# EAGLE design pwrfet (EAGLE 4.13)

## Sheet 1 of 2
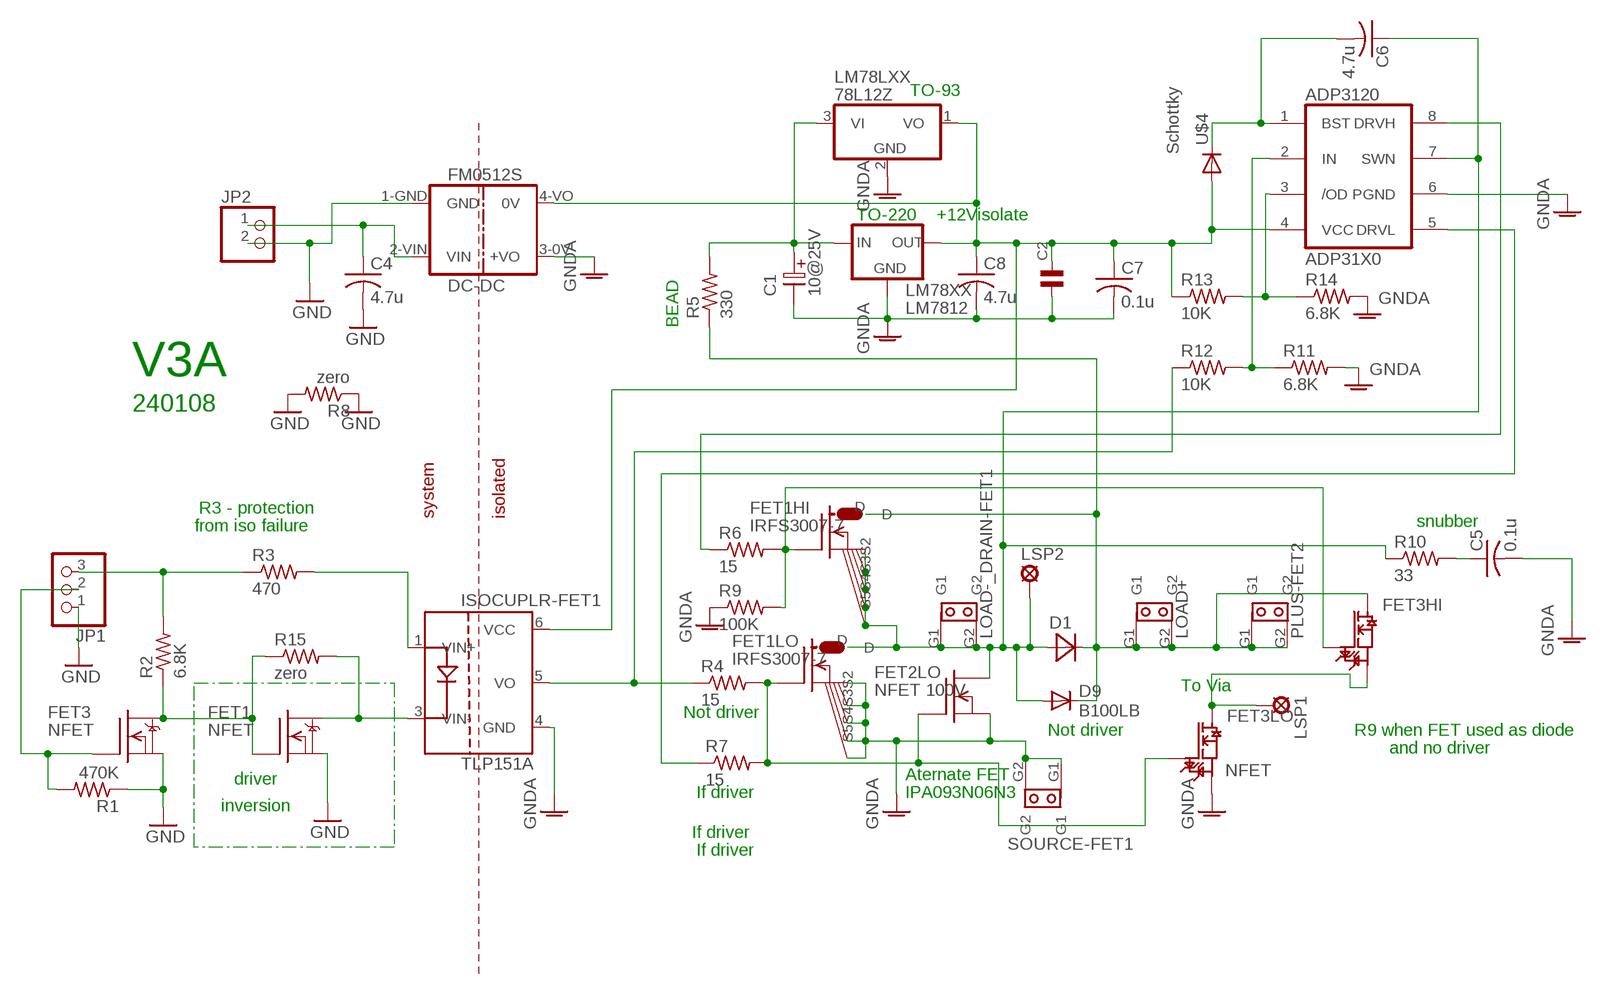
[diagram p0: schematic, sheet 1]

### Parts
ADP3120  ADP31X0  [SO08]
C1  10@25V  ELC-2,5L  [ES-2,5L]
C2  C1210  [1210]
C4  4.7u  C-USC0805  [C0805]
C5  0.1u  C-USC0603  [C0603]
C6  4.7u  C-USC0805  [C0805]
C7  0.1u  C-USC0603  [C0603]
C8  4.7u  C-USC0805  [C0805]
D1  DIODE-10  [D-10]
D9  B100LB  [SMB_1]
FET1  NFET  DMN3404L  [SOT-23]
FET1HI  IRFS3007-7  [D2PAK-7]
FET1LO  IRFS3007-7  [D2PAK-7]
FET2LO  NFET 100V  RFP30N06  [TO220V]
FET3  NFET  DMN3404L  [SOT-23]
FET3HI  NFET-DT  [D-PAK-4]
FET3LO  NFET  NFET-DT  [D-PAK-4]
FM0512S  DC-DC  [DC-DC]
ISOCUPLR-FET1  TLP151A  [SOT23-5X]
JP1  PINHD-1X3  [1X03]
JP2  PINHD-1X2  [1X02]
LM78LXX  78L12Z  [TO92]
LM78XX  LM7812  78XXS  [78XXS]
LOAD+  SPADE-TAB  [SPADE_TAB]
LOAD-_DRAIN-FET1  SPADE-TAB  [SPADE_TAB]
LSP1  LoadB  LSP10  [LSP10]
LSP2  LoadB  LSP10  [LSP10]
PLUS-FET2  SPADE-TAB  [SPADE_TAB]
R1  470K  R-US_R0603  [R0603]
R2  6.8K  R-US_R0603  [R0603]
R3  470  R-US_R0603  [R0603]
R4  15  R-US_R0603  [R0603]
R5  330  R-US_R0603  [R0603]
R6  15  R-US_R0603  [R0603]
R7  15  R-US_R0603  [R0603]
R8  zero  R-US_R0603  [R0603]
R9  100K  R-US_R0603  [R0603]
R10  33  R-US_R0603  [R0603]
R11  6.8K  R-US_R0603  [R0603]
R12  10K  R-US_R0603  [R0603]
R13  10K  R-US_R0603  [R0603]
R14  6.8K  R-US_R0603  [R0603]
R15  zero  R-US_R0603  [R0603]
SOURCE-FET1  SPADE-TAB  [SPADE_TAB]
U$4  Schottky  PMEG10020PMEG10020-123W  [SOD123W]

### Nets
+5VAUX: C4.1 FM0512S.2-VIN(VIN) JP2.1
+12VISO: ADP3120.4(VCC) C2.2 C7.1 C8.1 FM0512S.4-VO(0V) ISOCUPLR-FET1.6(VCC) LM78LXX.1(VO) LM78XX.OUT R13.1 U$4.C(A)
+PWR: D1.2(K) D9.C FET1HI.D FET3HI.D LOAD+.G1 LOAD+.G2 PLUS-FET2.G1 PLUS-FET2.G2 R5.1
+PWR_RC: C1.1 LM78LXX.3(VI) LM78XX.IN R5.2
/OD: ADP3120.3(/OD) R13.2 R14.1
DRAINFET1: ADP3120.7(SWN) C6.1 D1.1(A) D9.A FET1HI.S2(S1) FET1HI.S3(S2) FET1HI.S5(S3) FET1HI.S6(S4) FET1HI.S7(S5) FET1LO.D FET2LO.2(D) LOAD-_DRAIN-FET1.G1 LOAD-_DRAIN-FET1.G2 LSP2.MP R10.1
FET2GATE: FET1HI.G FET3HI.G R6.2 R9.2
FET3-LOAD: FET3HI.S FET3LO.D LSP1.MP
GATE-FET1: FET1LO.G FET2LO.1(G) FET3LO.G R4.2 R7.2
GND: C4.2 FET1.2(S) FET3.2(S) FM0512S.1-GND(GND) JP1.1 JP2.2 R1.1 R8.1 R8.2
GNDA: ADP3120.6(PGND) C1.2 C2.1 C5.2 C7.2 C8.2 FET1LO.S2(S1) FET1LO.S3(S2) FET1LO.S5(S3) FET1LO.S6(S4) FET1LO.S7(S5) FET2LO.3(S) FET3LO.S FM0512S.3-0V(+VO) ISOCUPLR-FET1.4(GND) LM78LXX.2(GND) LM78XX.GND R9.1 R11.2 R14.2 SOURCE-FET1.G1 SOURCE-FET1.G2
HO: ADP3120.8(DRVH) R6.1
IN: ISOCUPLR-FET1.5(VO) R4.1 R12.1
IN-DIVIDED: ADP3120.2(IN) R11.1 R12.2
ISO-ANODE: ISOCUPLR-FET1.1(VIN+) R3.2
ISO-IN-DRAIN-FET1: FET1.1(G) FET3.3(D) R2.1 R15.1
LO: ADP3120.5(DRVL) R7.1
N$1: JP1.3 R2.2 R3.1
N$2: FET1.3(D) ISOCUPLR-FET1.3(VIN-) R15.2
N$3: ADP3120.1(BST) C6.2 U$4.A(C)
ONOFF-FET1: FET3.1(G) JP1.2 R1.2
SNUB-RC: C5.1 R10.2

### Notes on the sheet
- TO-93
- TO-220 | +12Visolate
- BEAD
- V3A
- 240108
- R3 - protection | system | isolated
- from iso failure | snubber
- To Via
- Not driver
- Not driver | R9 when FET used as diode
- and no driver
- driver | Aternate FET
- If driver | IPA093N06N3
- inversion
- If driver
- If driver

## Sheet 2 of 2

## Library data of the parts
ADP3120 = 74xx-us:ADP31X0
C1 = DEH:ELC-2,5L
C2 = capsmd:C1210
C4-C8 = rcl:C-US: CAPACITOR, American symbol
D1 = DEH:DIODE-10
D9 = diode-1:B100LB
FET1 FET3 = transistor-fet:DMN3404L
FET1HI FET1LO = transistor-fet:IRFS3007-7
FET2LO = transistor-fet:RFP30N06
FET3HI FET3LO = DEH:NFET-DT
FM0512S = DEH:DC-DC
ISOCUPLR-FET1 = texas:TLP151A
JP1 = pinhead:PINHD-1X3: PIN HEADER
JP2 = pinhead:PINHD-1X2: PIN HEADER
LM78LXX = linear:78*: Positive VOLTAGE REGULATOR
LM78XX = v-reg:78XXS: VOLTAGE REGULATOR
LOAD+ LOAD-_DRAIN-FET1 PLUS-FET2 SOURCE-FET1 = DEH:SPADE-TAB
LSP1 LSP2 = solpad:LSP10: SOLDER PAD drill 1.0 mm, distributor Buerklin, 12H555
R1-R15 = rcl:R-US_: RESISTOR, American symbol
U$4 = diode-1:PMEG10020

## Board
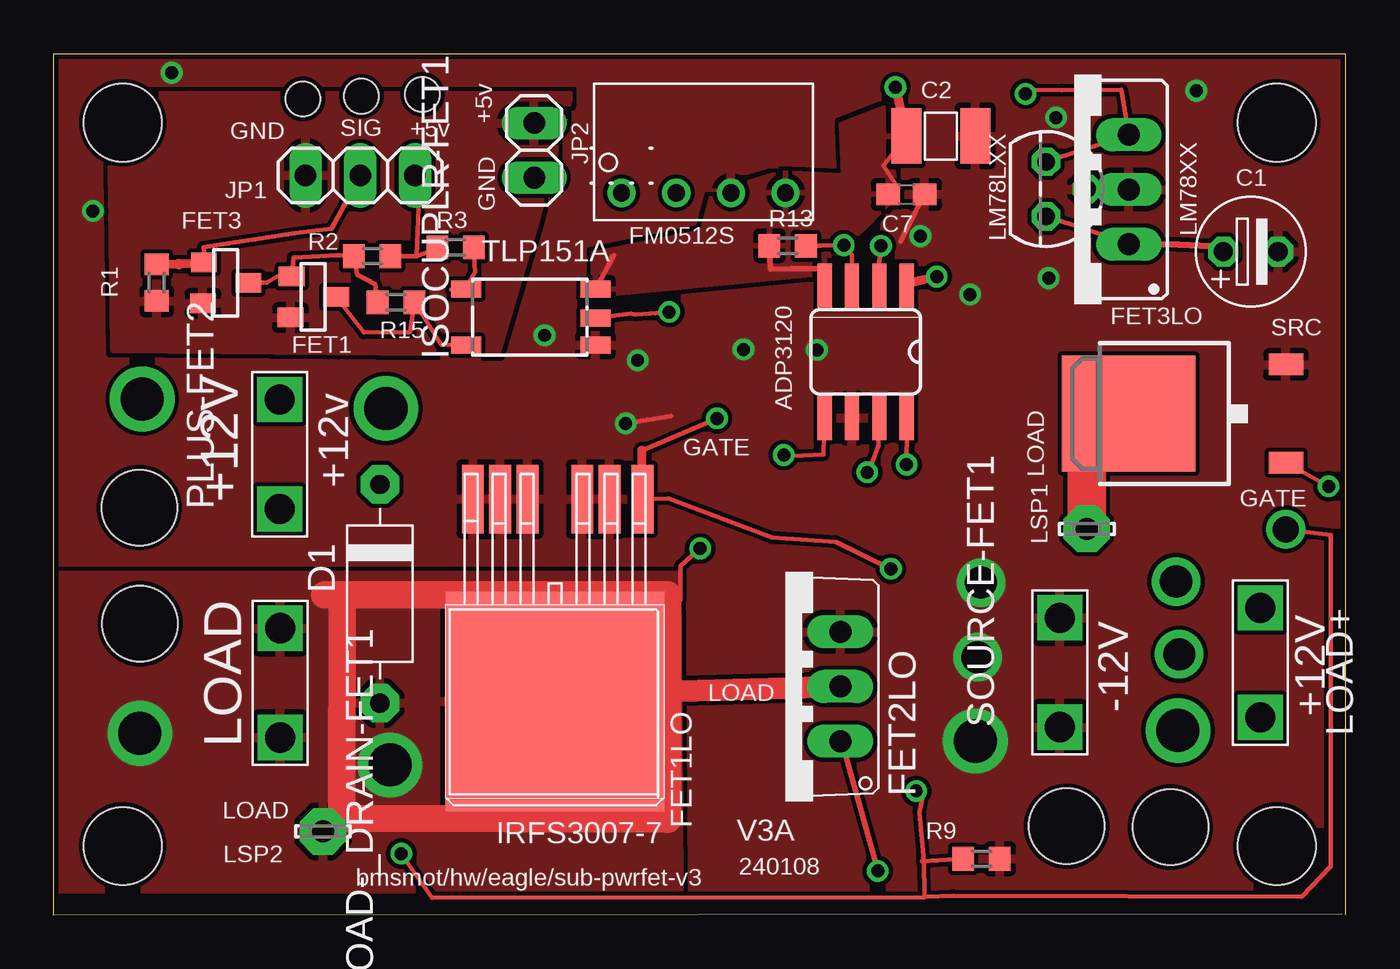
[diagram p1: board, top side]
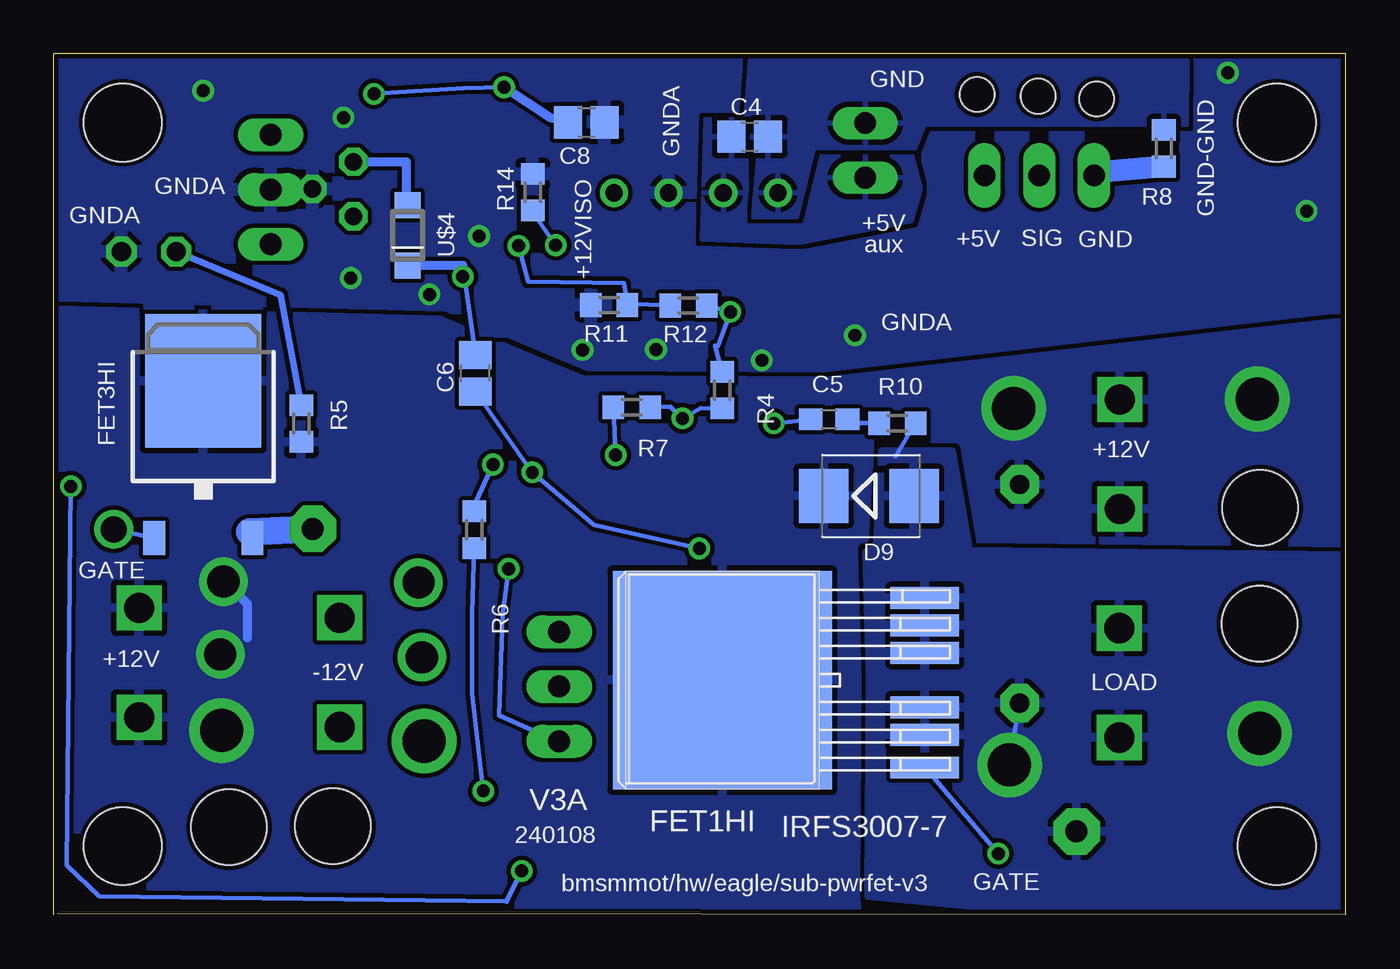
[diagram p2: board, bottom side, seen from below]

Size 60 x 40 mm. Coordinates in mm from the lower left corner, seen from the top.
Outline: 59.81,0.05 0,0 0,40 60,40 60,0
Copper layers (1*16): Top 0.035mm / dielectric 1.5mm / Bottom 0.035mm
Design rules "default": minimum track width 0.2mm, minimum drill 0.6mm, track to track 0.2mm, track to pad 0.2mm, pad to pad 0.2mm, via to via 8mil, smd to smd 0.2mm, copper to edge 9mil, drill to drill 8mil, minimum pad ring 10mil, minimum via ring 8mil, stop-mask expansion 4mil, vias tented up to drill 0mil, thermal gap 10mil
Holes 3.6 mm at 3.2,3.2 3.2,36.8 56.8,36.8 56.8,3.2
Holes 3.5 mm at 51.86,4.08 3.97,18.92 4.01,13.53 47.04,4.12
Holes 1.6 mm at 11.57,37.91 14.28,38.03 17.12,38.12

### Footprints (pad centres in the part's own frame; a part is rotated, then mirrored left to right if it is on the bottom)
SO08 = smd 0.66 x 2.032: 1 -1.905,-3.073; 2 -0.635,-3.073; 3 0.635,-3.073; 4 1.905,-3.073; 5 1.905,3.073; 6 0.635,3.073; 7 -0.635,3.073; 8 -1.905,3.073
ES-2,5L = drill 0.889 pad 1.27 octagon: 1 0,0; 2 2.54,0
1210 = smd 1.397 x 2.591: 1 -1.6,0; 2 1.6,0
C0805 = smd 1.3 x 1.5: 1 -0.85,0; 2 0.85,0
C0603 = smd 1.1 x 1: 1 -0.85,0; 2 0.85,0
D-10 = drill 0.889 pad 1.778 octagon: 1 -5.08,0; 2 5.08,0
SMB_1 = smd 2.3 x 2.5: A 1.9,0; C -2.3,0
SOT-23 = smd 0.9 x 1.2: 1 -1,-1.006; 2 0.9,-1.056; 3 -0.05,1.056
D2PAK-7 = smd 10.16 x 10.16: D 0,4.572 | smd 1.016 x 3.175: G -4.064,-4.826; S2 -2.54,-4.826; S3 -1.27,-4.826; S5 1.27,-4.826; S6 2.54,-4.826; S7 3.81,-4.826
TO220V = drill 1.016 long: 1 -2.54,-2.54; 2 0,-2.54; 3 2.54,-2.54
D-PAK-4 = smd 5.4 x 6.2: D 0,-0.04 | smd 1 x 1.6: G -2.28,-7.34; S 2.28,-7.34
DC-DC = drill 0.8 round: 1-GND 0,-1.27; 2-VIN 2.54,-1.27; 3-0V 5.08,-1.27; 4-VO 7.62,-1.27
SOT23-5X = smd 0.8 x 1.4: 1 1.35,2.97; 3 -1.25,2.97; 4 -1.25,-3.03; 5 0,-3.03; 6 1.35,-3.03
1X03 = drill 1 long: 1 -2.54,0; 2 0,0; 3 2.54,0
1X02 = drill 1 long: 1 -1.27,0; 2 1.27,0
TO92 = drill 0.813 octagon: 1 -1.27,0; 2 0,1.905; 3 1.27,0
78XXS = drill 1.016 long: GND 0,-2.54; IN -2.54,-2.54; OUT 2.54,-2.54
SPADE_TAB = drill 1.4 square: G1 -2.54,0; G2 2.54,0
LSP10 = drill 1.016 pad 2.159 octagon: MP 0,0
R0603 = smd 1 x 1.1: 1 -0.85,0; 2 0.85,0
SOD123W = smd 1.2 x 1.2: A 1.4,0; C -1.4,0

### Placement (x,y rotation side)
ADP3120  37.71,26.16 180 top
C1  54.32,30.81 0 top
C2  41.2,36.18 180 top
C4  27.68,36.15 0 bottom
C5  23.99,23.02 180 bottom
C6  40.42,25.16 90 bottom
C7  39.6,33.47 0 top
C8  35.26,36.82 0 bottom
D1  15.14,14.92 90 top
D9  21.94,19.46 0 bottom
FET1  12.05,28.66 270 top
FET1HI  24.38,10.91 90 bottom
FET1LO  23.27,14.49 180 top
FET2LO  33.99,10.61 90 top
FET3  7.98,29.31 270 top
FET3HI  53.06,24.85 0 bottom
FET3LO  49.88,23.29 90 top
FM0512S  26.36,34.81 0 top
ISOCUPLR-FET1  22.12,27.72 90 top
JP1  14.23,34.35 0 top
JP2  22.31,35.52 90 top
LM78LXX  46.08,33.72 270 top
LM78XX  47.39,33.7 90 top
LOAD+  56.03,11.72 270 top
LOAD-_DRAIN-FET1  10.52,10.78 270 top
LSP1  47.98,17.93 0 top
LSP2  12.5,3.88 0 top
PLUS-FET2  10.49,21.4 90 top
R1  4.78,29.37 90 top
R2  14.79,30.6 0 top
R3  18.65,31.01 0 top
R4  28.96,24.37 270 bottom
R5  48.5,22.82 90 bottom
R6  40.47,17.89 270 bottom
R7  33.16,23.58 0 bottom
R8  8.45,35.61 90 bottom
R9  43.09,2.61 180 top
R10  20.82,22.84 180 bottom
R11  34.21,28.33 180 bottom
R12  30.53,28.31 180 bottom
R13  34.08,31.09 0 top
R14  37.75,33.57 90 bottom
R15  15.89,28.45 0 top
SOURCE-FET1  46.73,11.26 90 top
U$4  43.57,31.56 270 bottom

### Tracks (layer width: path | path; a pad name or v marks a point on that pad's centre or on a via)
+5VAUX
  pour Bottom (rank 3): 29.9,31.36 29.73,36.96 27.87,36.95 27.78,32.33 26.45,32.04 25.35,32.23 24.45,35.7 20.23,35.63 19.74,33.74 20.16,32.24 25.4,31.21
+12VISO  (via drill 0.6)
  Top 0.202: LM78XX.OUT LM78LXX.1 | C2.2 38.53,34.79 39.23,33.74
  Top 0.203: v45.13,38.14 45.5,38.33 46.81,38.32 49.58,38.32 LM78XX.OUT | ISOCUPLR-FET1.6 26.03,30.66 25.9,30.59 | 35.78,30.02 ADP3120.4
  Top 0.254: ISOCUPLR-FET1.6 25.18,29.11 | 35.78,30.02 34.27,30.02 33.29,29.99 R13.1
  Top 0.406: C2.2 39.57,36.24 v39.09,38.45
  Bottom 0.202: v45.13,38.14 40.97,38.41 v39.09,38.45
  Bottom 0.406: U$4.C 43.63,32.96 43.63,34.99 LM78LXX.1 | 36.12,36.82 36.12,36.81 | C8.1 36.12,36.82 | v39.09,38.45 36.91,37.01 36.12,36.82
  pour Top: 31.61,33.86 30.66,33.86 30.1,31.77 25.04,30.75 25.04,29.15 26.03,28.83 35.18,29.71 37.71,31.97 39.14,33.44 38.69,37.57 36.56,36.74 36.64,34.36 33.77,34.5
+PWR  (via drill 1.5, 2)
  Bottom 0.406: v52.12,15.49 51.01,14.45 51.01,12.87
  other vias: 52.21,8.57 4.11,23.96 52.27,12.1 15.42,23.53
  pour Bottom (rank 3): -1.34,-1.99 -1.4,27.71 24.06,24.8 35.47,24.87 42.06,27.64 62.46,28.16 62.14,-2.04
+PWR_RC
  Top 0.202: LM78XX.IN 50.02,31.17 LM78LXX.3
  Top 0.305: LM78XX.IN 52.25,31.15 53.68,31.06 C1.1
  Bottom 0.305: R5.2 49.46,28.79 C1.1
/OD  (via drill 0.6)
  Top 0.203: ADP3120.3 37.07,30.64 v36.69,31.11 35.69,31.1 R13.2
  Bottom 0.203: R14.1 37.74,32.62 v36.69,31.11
DRAINFET1  (via drill 0.6, 2)
  Top 0.202: v30.02,17.02 29.11,16.21 29.1,14.66 28.5,14.85
  Top 0.203: v37.78,20.56 38.05,21.11 38.3,21.81 38.33,23.15 ADP3120.7
  Top 1.016: 28.5,10.39 28.27,10.39 FET2LO.2
  Top 1.27: 12.58,14.87 28.5,14.87 28.5,14.85 28.5,10.39 28.51,4.45 13.37,4.48 13.39,14.78
  Bottom 0.202: v30.02,17.02 34.91,18.12 | R10.1 20.92,21.3
  Bottom 0.203: v15.61,6.97 15.18,9.71 | C6.1 v37.78,20.56 37.75,20.53 34.91,18.12
  other vias: 4,8.43
  pour Top (rank 2): 28.95,15.79 29.05,1.19 -1.51,1.16 -1.7,15.79 4.24,15.79
  pour Bottom (rank 2): 22.09,11.14 22.16,0.91 -3.55,-1.57 -3.31,4.74 -0.2,16.66 17.49,16.89 18.3,21.5 21.52,21.52 21.77,17.04 22.25,16.84
FET2GATE  (via drill 0.6, 1.2)
  Top 0.202: v16.14,2.85 17.58,0.8 40.44,0.81 40.44,0.85 40.4,2.49 40.2,4.77
  Top 0.203: 40.2,4.77 40.4,5.75 v40.05,5.75 | v57.22,17.91 59.3,17.66 59.31,2.26 57.95,0.85 41.77,0.89 40.45,0.85 40.44,0.85 | 40.4,2.49 40.32,2.48 R9.2
  Bottom 0.202: v16.14,2.85 FET1HI.G
  Bottom 0.203: v40.05,5.75 40.58,10.28 40.58,13.64 40.58,13.97 R6.2 | v57.22,17.91 FET3HI.G
FET3-LOAD
  Top 1.778: LSP1.MP 47.99,21.5 49.82,23.34 FET3LO.D
  Bottom 0.61: FET3HI.S 50.91,17.78
  Bottom 1.27: 50.91,17.78 LSP1.MP
GATE-FET1  (via drill 0.6)
  Top 0.203: 27.32,21.57 v30.8,23.06 | FET1LO.G 28.56,19.35 33.35,17.53 36.33,17.33 v38.88,16.07 | v59.21,19.91 FET3LO.G
  Top 0.254: FET2LO.1 36.62,7.95 v38.27,2.04
  Top 0.406: FET1LO.G 27.32,21.57
  Bottom 0.202: R4.2 29.95,23.55 v30.8,23.06 31.38,23.61 R7.2
  Bottom 0.203: v38.88,16.07 39.17,13.91 39.33,9.26 36.67,8.08 FET2LO.1 36.74,7.94 | v59.21,19.91 59.41,2.3 57.89,0.86 38.97,0.62
  Bottom 0.254: 36.74,7.94 36.7,7.74 36.6,7.98 | v38.27,2.04 38.97,0.62
GND
  Bottom 1.016: JP1.1 11.69,34.48 R8.1
  pour Top (rank 2): 23.93,38.09 22.32,32.15 20.54,26.12 20.1,26.12 2.82,26.28 2.67,38.09
  pour Bottom (rank 2): 20.04,35.62 24.72,35.63 25.51,32.44 27.51,32.42 27.21,35.79 27.96,35.82 27.64,39.71 7.38,39.67 7.39,36.71 19.59,36.72
GNDA  (via drill 0.6, 1.5, 2)
  Top 0.202: 39.33,31.27 C7.2 | v26.56,22.83 28.67,23.18
  Bottom 0.202: C5.2 v26.56,22.83
  other vias: 43.06,15.44 42.8,8.07 42.91,11.97 40.25,31.53 32.03,26.27 27.11,25.76 22.79,26.92 35.44,26.24 46.21,29.58 46.55,37.04 53.06,38.29 42.56,28.82 1.81,32.7 5.47,39.12
  pour Top (rank 3): -1.97,41.09 19.27,41.02 61.99,40.99 62.24,-2 -1.37,-2.17 -1.44,16.74
  pour Bottom (rank 5): -3.66,27.45 21.11,23.51 42.69,24.36 64.46,28.29 64.36,41.41 -3.7,41.54
HO  (via drill 0.6)
  Top 0.202: 39.62,22.57 39.62,23
  Top 0.203: v39.61,20.93 39.62,22.57 | ADP3120.8 39.62,23
  Bottom 0.203: 40.55,18.85 v39.61,20.93
  Bottom 0.406: R6.1 40.55,18.85
IN  (via drill 0.6)
  Top 0.202: 27.03,27.88 27.66,27.94 v28.58,28.01
  Top 0.203: ISOCUPLR-FET1.5 26.81,27.92 27.03,27.88
  Bottom 0.202: R4.1 29.29,26.44 29.16,26.43 v28.58,28.01
  Bottom 0.203: v28.58,28.01 28.57,28.03 R12.1
IN-DIVIDED  (via drill 0.6)
  Top 0.203: v38.42,31.08 38.43,31.04 38.32,30.27 ADP3120.2
  Bottom 0.203: R12.2 33.39,28.4 R11.1 33.51,29.34 37.98,29.41 v38.42,31.08
ISO-ANODE
  Top 0.203: 18.46,29.04 ISOCUPLR-FET1.1 19.12,29.14 19.56,29.86 R3.2
ISO-IN-DRAIN-FET1
  Top 0.203: R15.1 14.93,29.3 14.1,29.75 R2.1 13.93,30.61 13.21,30.65 11.14,30.54 FET1.1 11.02,29.68 10.37,29.64 9.88,29.38 FET3.3
LO  (via drill 0.6)
  Top 0.203: ADP3120.5 35.73,21.38 33.84,21.29 v33.9,21.36
  Bottom 0.202: v33.9,21.36 R7.1
N$1
  Top 0.203: JP1.3 16.98,33.97 16.86,30.63 16.86,30.61 | R2.2 16.57,30.6 16.86,30.61 | R3.1 17.88,31 16.86,30.61
N$2
  Top 0.203: ISOCUPLR-FET1.3 17.99,26.5 16.76,28.46 R15.2 16.76,28.48 16.55,27.07 14.41,27.04 FET1.3
N$3  (via drill 0.6)
  Top 0.406: ADP3120.1 39.61,29.31 v41.01,29.65
  Bottom 0.203: v41.01,29.65 40.92,29.59 C6.2
  Bottom 0.406: U$4.A 41.01,30.16 v41.01,29.65
ONOFF-FET1
  Top 0.203: 7.02,30.31 6.95,31.02 11.2,31.66 12.91,31.88 14.23,34.32 JP1.2
  Top 0.406: FET3.1 7.02,30.31 5.8,30.26 | R1.2 5.8,30.26 | 5.8,30.26 5.8,30.2 | JP1.2 14.15,34.22
SNUB-RC
  Bottom 0.202: C5.1 22.53,22.86 R10.2

### Text on the board
tPlace: GND | +5v | +5v | SIG | GND
bPlace: GNDA
tNames: TLP151A | SRC | GATE | +12v | LOAD | +12V | GATE | -12V | +12V | LOAD | LOAD | LOAD | IRFS3007-7 | V3A | 240108 | bmsmot/hw/eagle/sub-pwrfet-v3
bNames: GNDA | GND-GND | GND | +12VISO | +5V | GNDA | GND | SIG | +5V | aux | GNDA | +12V | GATE | +12V | -12V | LOAD | V3A | IRFS3007-7 | 240108 | GATE | bmsmmot/hw/eagle/sub-pwrfet-v3